# Altium schematic sheet System diagram.SchDoc
size A; Author: Tinh Chau; DrawnBy: Group 7; SheetNumber: 1; SheetTotal: 6
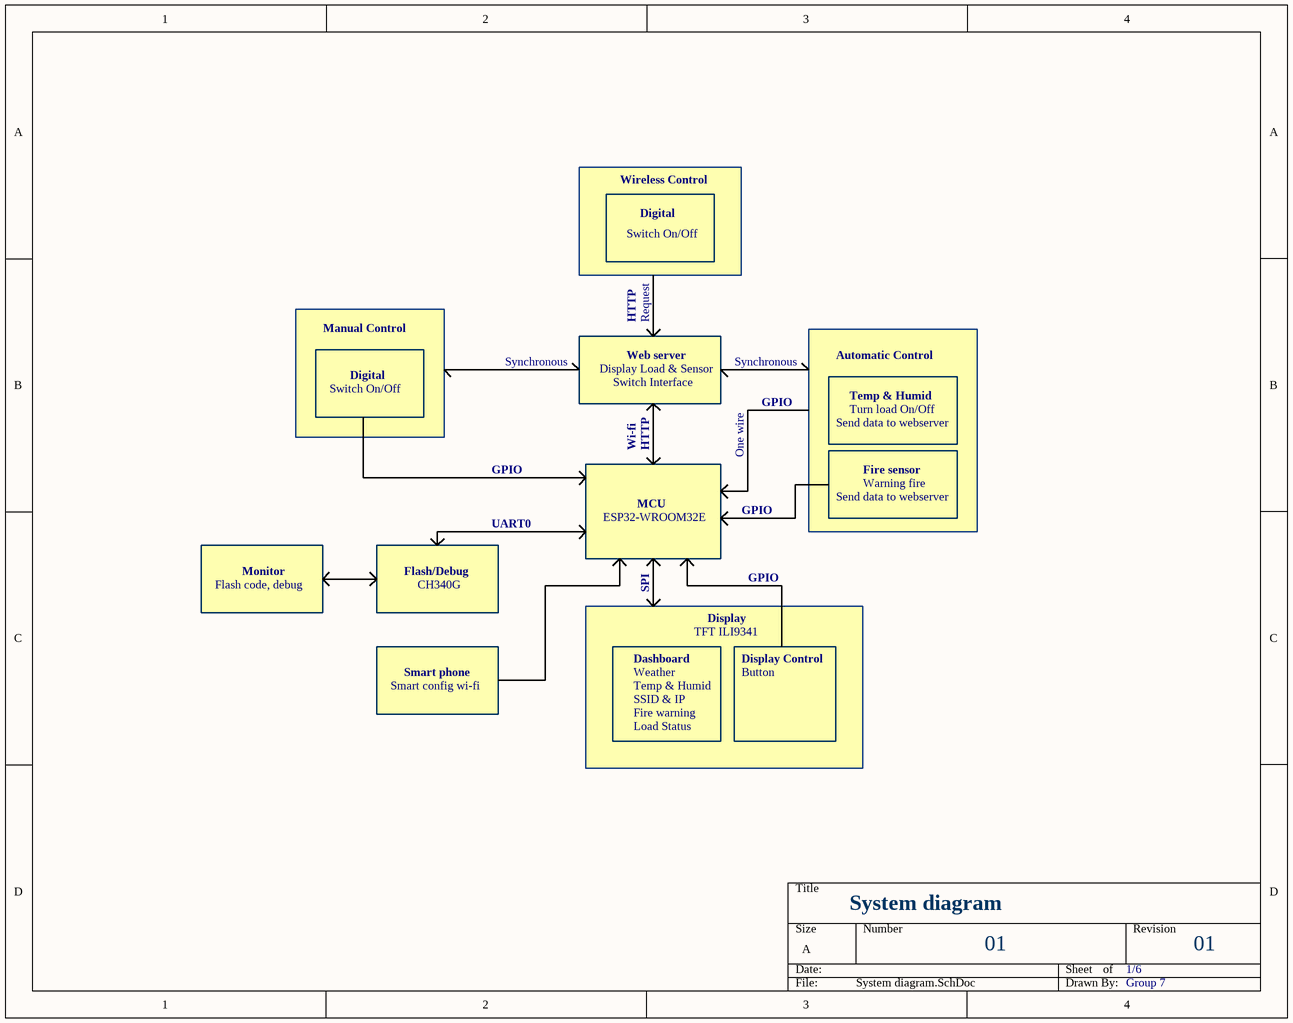
[diagram p0: System diagram.SchDoc]

## Notes on the sheet
- Wireless Control
- Switch On/Off
- Digital
- Manual Control
- Synchronous
- Display Load & Sensor
- Web server
- HTTP
- Request
- Automatic Control
- Switch Interface
- GPIO
- Send data to webserver
- Temp & Humid
- Turn load On/Off
- MCU
- Wi-fi
- One wire
- Fire sensor
- Warning fire
- UART0
- ESP32-WROOM32E
- Flash code, debug
- Monitor
- Flash/Debug
- CH340G
- SPI
- TFT ILI9341
- Display
- Smart config wi-fi
- Smart phone
- Dashboard
- Weather
- SSID & IP
- Display Control
- Button
- Fire warning
- Load Status
- System diagram
- 01
- 1/6
- Group 7